# Altium schematic sheet main.SchDoc
size A4; SheetNumber: 1; SheetTotal: 2
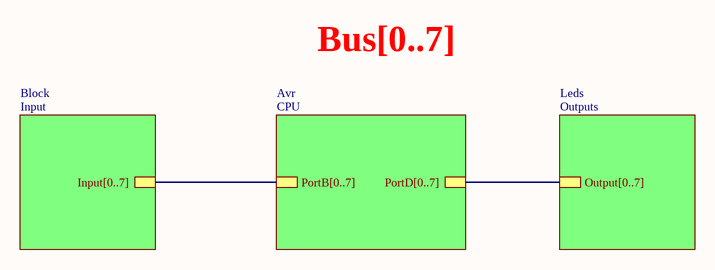
[diagram p0: main.SchDoc]

## Sub-sheets
Avr = CPU: PortB[0..7], PortD[0..7]
Block = Input: Input[0..7]
Leds = Outputs: Output[0..7]

## Buses and harness runs
bus sheet Avr/PortB[0..7] = sheet Block/Input[0..7]
bus sheet Avr/PortD[0..7] = sheet Leds/Output[0..7]

## Notes on the sheet
- Bus[0..7]